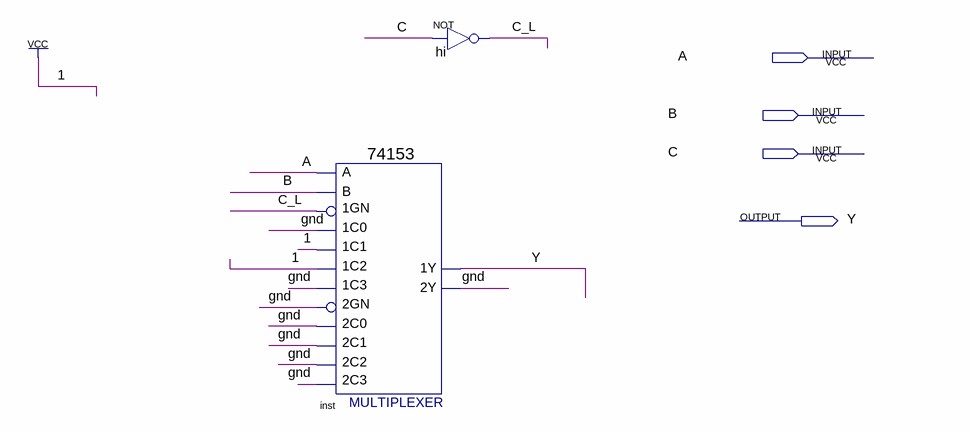
[diagram p0: schematic sheet]
// Quartus schematic Lab2_Quiz.bdf as structural Verilog: 2 symbols, 4 pins
module Lab2_Quiz (
  input  A,
  input  B,
  input  C,
  output Y
);

  wire C_L, gnd;

  \74153  inst (
    .\1C1 (1'b1), .\1GN (C_L), .\1C0 (gnd), .\2C0 (gnd), .\2GN (gnd), .\2C2 (gnd), .\1C2 (1'b1), .\1C3 (gnd),
    .B(B), .A(A), .\2C1 (gnd), .\2C3 (gnd), .\1Y (Y), .\2Y (gnd));
  not hi (C_L, C);
endmodule
